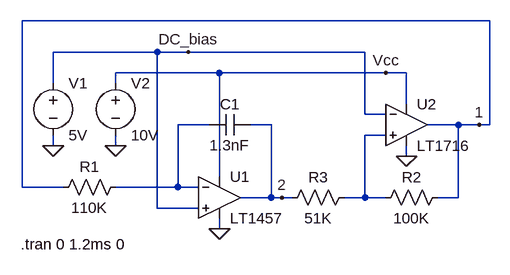
[diagram p0: schematic triangular-wave-oscillator.asc]
triangular-wave-oscillator.asc, the LTspice schematic file:
Version 4
SHEET 1 904 680
WIRE 736 -128 16 -128
WIRE 224 -80 64 -80
WIRE 272 -80 224 -80
WIRE 544 -80 272 -80
WIRE 320 -48 160 -48
WIRE 576 -48 320 -48
WIRE 608 -48 576 -48
WIRE 64 -32 64 -80
WIRE 160 -32 160 -48
WIRE 608 0 608 -48
WIRE 544 16 544 -80
WIRE 576 16 544 16
WIRE 304 32 256 32
WIRE 400 32 368 32
WIRE 688 32 640 32
WIRE 720 32 688 32
WIRE 736 32 736 -128
WIRE 736 32 720 32
WIRE 576 48 544 48
WIRE 64 64 64 48
WIRE 160 64 160 48
WIRE 608 80 608 64
WIRE 320 112 320 -48
WIRE 16 128 16 -128
WIRE 80 128 16 128
WIRE 256 128 256 32
WIRE 256 128 160 128
WIRE 288 128 256 128
WIRE 400 144 400 32
WIRE 400 144 352 144
WIRE 416 144 400 144
WIRE 432 144 416 144
WIRE 544 144 544 48
WIRE 544 144 512 144
WIRE 576 144 544 144
WIRE 688 144 688 32
WIRE 688 144 656 144
WIRE 224 160 224 -80
WIRE 288 160 224 160
WIRE 320 192 320 176
FLAG 64 64 0
FLAG 608 80 0
FLAG 320 192 0
FLAG 160 64 0
FLAG 576 -48 Vcc
FLAG 272 -80 DC_bias
FLAG 720 32 1
FLAG 416 144 2
SYMBOL res 176 112 R90
WINDOW 0 0 56 VBottom 2
WINDOW 3 32 56 VTop 2
SYMATTR InstName R1
SYMATTR Value 110K
SYMBOL OpAmps\\LT1457 320 144 R0
SYMATTR InstName U1
SYMBOL voltage 64 -48 R0
WINDOW 123 0 0 Left 0
WINDOW 39 0 0 Left 0
SYMATTR InstName V1
SYMATTR Value 5V
SYMBOL voltage 160 -48 R0
SYMATTR InstName V2
SYMATTR Value 10V
SYMBOL Comparators\\LT1716 608 32 R0
SYMATTR InstName U2
SYMBOL res 672 128 R90
WINDOW 0 0 56 VBottom 2
WINDOW 3 32 56 VTop 2
SYMATTR InstName R2
SYMATTR Value 100K
SYMBOL res 528 128 R90
WINDOW 0 0 56 VBottom 2
WINDOW 3 32 56 VTop 2
SYMATTR InstName R3
SYMATTR Value 51K
SYMBOL cap 368 16 R90
WINDOW 0 0 32 VBottom 2
WINDOW 3 32 32 VTop 2
SYMATTR InstName C1
SYMATTR Value 1.3nF
TEXT 14 216 Left 2 !.tran 0 1.2ms 0

The netlist it stands for:
* triangular-wave-oscillator.asc
R1 N001 1 110K
* U1: LT1457 (symbol OpAmps\LT1457 not available, pins judged from their places): In+=DC_bias In-=N001 V+=Vcc V-=0 OUT=2
V1 DC_bias 0 5V
V2 Vcc 0 10V
XU2 N002 DC_bias Vcc 0 1 LT1716  ; pins In+ In- V+ V- OUT
R2 1 N002 100K
R3 N002 2 51K
C1 2 N001 1.3nF
.tran 0 1.2ms 0
.lib LTC1.lib
.backanno
.end